# Altium schematic sheet Battery.SchDoc
size 297 x 209 mm
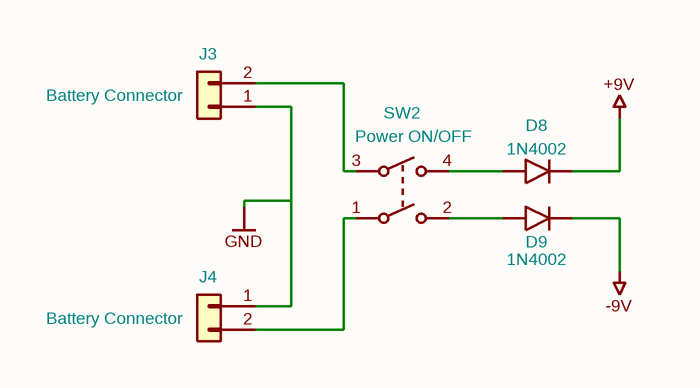
[diagram p0: Battery.SchDoc]

## Parts
D8  1N4002  [D_DO-41_SOD81_P10.16mm_Horizontal]
D9  1N4002  [D_DO-41_SOD81_P10.16mm_Horizontal]
J3  Battery Connector  [PinHeader_1x02_P2.54mm_Vertical]
J4  Battery Connector  [PinHeader_1x02_P2.54mm_Vertical]
SW2  Power ON/OFF  [SW_CuK_JS202011AQN_DPDT_Angled]

## Nets
+9V: D8.1(K)
-9V: D9.1(K)
GND: J3.1(Pin_1) J4.1(Pin_1)
NetD8_2: D8.2(A) SW2.4
NetD9_2: D9.2(A) SW2.2
NetJ3_2: J3.2(Pin_2) SW2.3
NetJ4_2: J4.2 SW2.1

## Notes on the sheet
- 1
- 2
- 3
- 4
- 5
- 6
- A
- B
- C
- Baterijsko napajanje
- D
- Title: Uređaj za merenje efektivne vrednosti AC napona
- File: Battery.kicad_sch
- Sheet: /
- Srđan Milkić
- KiCad E.D.A.  kicad (5.1.4)-1
- Size: A4
- Date: 2024-01-19
- Rev: 2
- Id: 1/1

## Library data of the parts
J3 = Conn_01x02_1: Value: Battery Connector; Footprint: Connector_PinHeader_2.54mm:PinHeader_1x02_P2.54mm_Vertical
J4 = Conn_01x02: Value: Battery Connector; Footprint: Connector_PinHeader_2.54mm:PinHeader_1x02_P2.54mm_Vertical
SW2 = SW_DPST: Value: Power ON/OFF; Footprint: Button_Switch_THT:SW_CuK_JS202011AQN_DPDT_Angled
D8 D9 = 1N4002: Value: 1N4002; Footprint: Diode_THT:D_DO-41_SOD81_P10.16mm_Horizontal